# EAGLE schematic demeler_pcb (EAGLE 6.1)
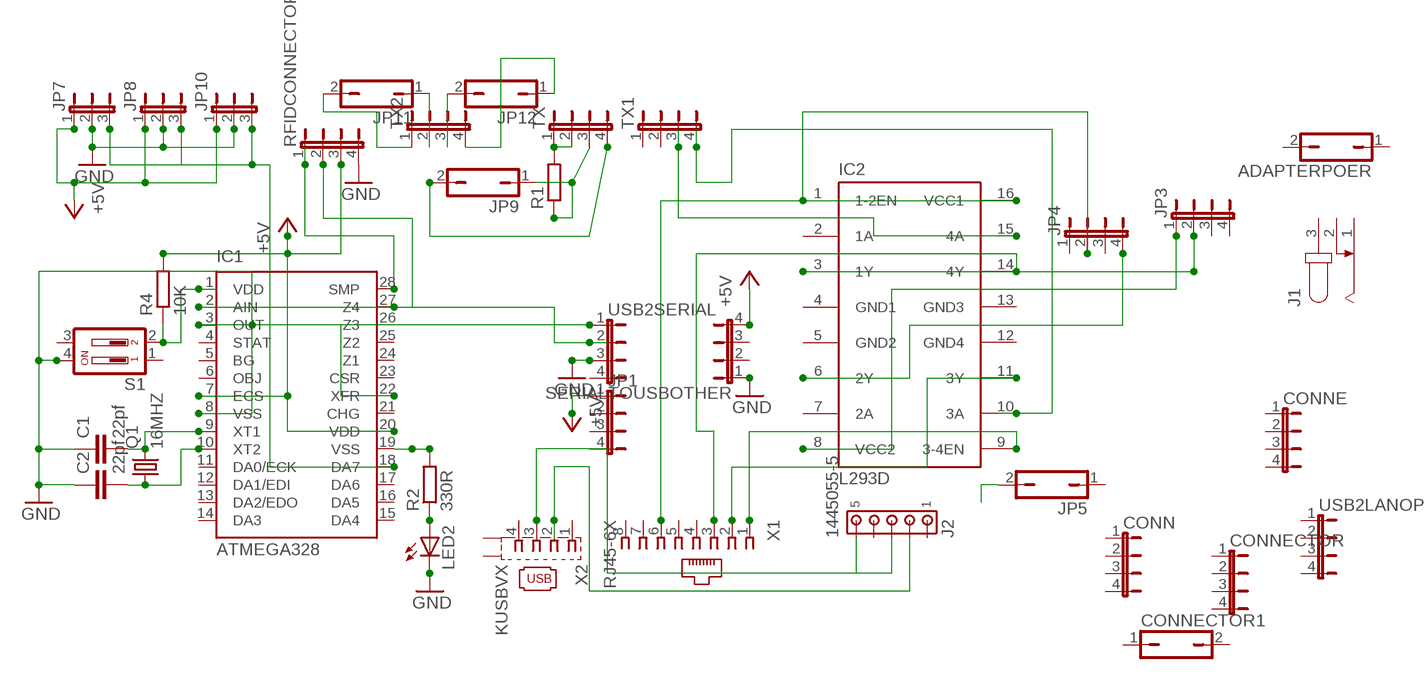
[diagram p0: schematic, sheet 1]

## Parts
ADAPTERPOER  JP1Q  [JP1]
C1  22pf  C2.5/2  [C2.5-2]
C2  22pf  C2.5/2  [C2.5-2]
CONN  JP4E  [JP4]
CONNE  JP4E  [JP4]
CONNECTOR  JP4E  [JP4]
CONNECTOR1  JP1Q  [JP1]
IC1  ATMEGA328  QT9701BD  [DIL28-3]
IC2  L293D  [DIL16]
J1  JACK-PLUG0  [SPC4077]
J2  1445055-5  [1445055-5]
JP1  JP4E  [JP4]
JP3  JP4E  [JP4]
JP4  JP4E  [JP4]
JP5  JP1Q  [JP1]
JP7  JP2E  [JP2]
JP8  JP2E  [JP2]
JP9  JP1Q  [JP1]
JP10  JP2E  [JP2]
JP11  JP1Q  [JP1]
JP12  JP1Q  [JP1]
LED2  LED3MM  [LED3MM]
Q1  16MHZ  CRYSTALHC49S  [HC49/S]
R1  R-EU_0204/7  [0204/7]
R2  330R  R-EU_0207/10  [0207/10]
R4  10K  R-EU_0207/10  [0207/10]
RFIDCONNECTOR  JP4E  [JP4]
S1  DP02  [DP-02]
SERIALTOUSBOTHER  JP4E  [JP4]
TX  JP4E  [JP4]
TX1  JP4E  [JP4]
TX2  JP4E  [JP4]
USB2LANOP  JP4E  [JP4]
USB2SERIAL  JP4E  [JP4]
X1  RJ45-6X  [RJ45-NO-SHIELD]
X2  KUSBVX  [KUSBVX]

## Nets
+5V: IC1.7(ECS) IC1.20(VDD) JP1.1 JP7.1 JP8.1 JP10.1 R4.2 RFIDCONNECTOR.3 SERIALTOUSBOTHER.4
GND: C1.1 C2.1 IC1.8(VSS) IC1.22(XFR) JP7.2 JP8.2 JP10.2 LED2.K(C) RFIDCONNECTOR.4 S1.4 SERIALTOUSBOTHER.1 USB2SERIAL.3
N$1: C1.2 IC1.9(XT1) Q1.2
N$2: C2.2 IC1.10(XT2) Q1.1
N$3: IC1.3(OUT) USB2SERIAL.1
N$4: J2.3 X2.3
N$5: IC1.19(VSS) R2.2
N$6: IC2.9(3-4EN) X1.1
N$7: IC2.11(3Y) X1.2
N$8: IC2.14(4Y) X1.3
N$9: IC2.16(VCC1) X1.6
N$10: IC2.8(VCC2) JP3.1
N$11: IC2.6(2Y) JP4.4
N$12: IC2.3(1Y) JP3.2
N$13: IC2.1(1-2EN) JP4.2
N$14: IC2.10(3A) TX1.4
N$15: IC2.15(4A) TX1.3
N$16: IC1.2(AIN) USB2SERIAL.2
N$17: R1.2 TX.1 TX.2
N$18: JP9.1 R1.1 TX.3
N$19: J2.5
N$20: J2.2 X2.2
N$21: JP9.2 TX.4
N$23: JP5.2
N$24: IC1.27(Z4) RFIDCONNECTOR.2
N$25: IC1.28(SMP) RFIDCONNECTOR.1
N$26: IC1.18(DA7) JP7.3 JP8.3 JP10.3
N$27: JP11.2 TX2.1
N$28: JP11.1 TX2.2
N$29: JP12.2 TX2.3
N$30: JP12.1 TX2.4
N$31: IC1.1(VDD) R4.1 S1.2
N$32: LED2.A R2.1
Unconnected: ADAPTERPOER.1 ADAPTERPOER.2 CONN.1 CONN.2 CONN.3 CONN.4 CONNE.1 CONNE.2 CONNE.3 CONNE.4 CONNECTOR1.1 CONNECTOR1.2 CONNECTOR.1 CONNECTOR.2 CONNECTOR.3 CONNECTOR.4 IC1.4(STAT) IC1.5(BG) IC1.6(OBJ) IC1.11(DA0/ECK) IC1.12(DA1/EDI) IC1.13(DA2/EDO) IC1.14(DA3) IC1.15(DA4) IC1.16(DA5) IC1.17(DA6) IC1.21(CHG) IC1.23(CSR) IC1.24(Z1) IC1.25(Z2) IC1.26(Z3) IC2.2(1A) IC2.7(2A) J1.1 J1.2 J1.3 J2.1 J2.4 JP1.2 JP1.3 JP1.4 JP3.3 JP3.4 JP4.1 JP4.3 JP5.1 S1.1 S1.3 SERIALTOUSBOTHER.2 SERIALTOUSBOTHER.3 TX1.1 TX1.2 USB2LANOP.1 USB2LANOP.2 USB2LANOP.3 USB2LANOP.4 USB2SERIAL.4 X1.4 X1.5 X1.7 X1.8 X2.1 X2.4 X2.M1(S1) X2.M2(S2)

## Power pins joined to a net without a drawn wire
GND1: IC2.4(GND1)
GND2: IC2.5(GND2)
GND3: IC2.13(GND3)
GND4: IC2.12(GND4)

## Library data of the parts
ADAPTERPOER CONNECTOR1 JP5 JP9 JP11 JP12 = jumper:JP1Q: JUMPER
C1 C2 = capacitor-wima:C: CAPACITOR naming: grid - package width
CONN CONNE CONNECTOR JP1 JP3 JP4 RFIDCONNECTOR SERIALTOUSBOTHER TX TX1 TX2 USB2LANOP USB2SERIAL = jumper:JP4E: JUMPER
IC1 = quantum-research-group:QT9701B: Charge-Transfer Capacitance Sensor IC Source: http://data.qprox.com/downloads/datasheets/qt9701b.pdf; OC_FARNELL: unknown; OC_NEWARK: unknown
IC2 = st-microelectronics:L293D: PUSH-PULL 4 CHANNEL DRIVER; MPN: L293D; OC_FARNELL: 9589619; OC_NEWARK: 56P8249
J1 = con-jack:JACK-PLUG: DC POWER JACK Power Jack, DC, Right Angle, Through Hole, Rated 5A at 16VDC, PC Terminals Distributor: Farnell (www.Farnell.de) Drawing: 84N1161.pdf / 84N1162.pdf Manufacturer: SPC Technology (www.spctechnology.com) Type: SPC4077 / SPC 4078; OC_FARNELL: unknown; OC_NEWARK: unknown
J2 = con-amp:1445055-5: Micro MATE-N-LOK Connectors grid 1.5 mm Source: ENG_CD_1445055_A.pdf
JP7 JP8 JP10 = jumper:JP2E: JUMPER
LED2 = led:LED: LED OSRAM: - CHIPLED LG R971, LG N971, LY N971, LG Q971, LY Q971, LO R971, LY R971 LH N974, LH R974 LS Q976, LO Q976, LY Q976 LO Q996 - Hyper CHIPLED LW Q18S LB Q993, LB Q99A, LB R99A - SideLED LS A670, LO A670, LY A670, LG A670, LP A670 LB A673, LV A673, LT A673, LW A673 LH A674 LY A675 LS A676, LA A676, LO A676, LY A676, LW A676 LS A679, LY A679, LG A679 - Hyper Micro SIDELED® LS Y876, LA Y876, LO Y876, LY Y876 LT Y87S - SmartLED LW L88C, LW L88S LB L89C, LB L89S, LG L890 LS L89K, LO L89K, LY L89K LS L896, LA L896, LO L896, LY L896 - TOPLED LS T670, LO T670, LY T670, LG T670, LP T670 LSG T670, LSP T670, LSY T670, LOP T670, LYG T670 LG T671, LOG T671, LSG T671 LB T673, LV T673, LT T673, LW T673 LH T674 LS T676, LA T676, LO T676, LY T676, LB T676, LH T676, LSB T676, LW T676 LB T67C, LV T67C, LT T67C, LS T67K, LO T67K, LY T67K, LW E67C LS E67B, LA E67B, LO E67B, LY E67B, LB E67C, LV E67C, LT E67C LW T67C LS T679, LY T679, LG T679 LS T770, LO T770, LY T770, LG T770, LP T770 LB T773, LV T773, LT T773, LW T773 LH T774 LS E675, LA E675, LY E675, LS T675 LS T776, LA T776, LO T776, LY T776, LB T776 LHGB T686 LT T68C, LB T68C - Hyper Mini TOPLED® LB M676 - Mini TOPLED Santana® LG M470 LS M47K, LO M47K, LY M47K Source: http://www.osram.convergy.de LUXEON: - LUMILED® LXK2-PW12-R00, LXK2-PW12-S00, LXK2-PW14-U00, LXK2-PW14-V00 LXK2-PM12-R00, LXK2-PM12-S00, LXK2-PM14-U00 LXK2-PE12-Q00, LXK2-PE12-R00, LXK2-PE12-S00, LXK2-PE14-T00, LXK2-PE14-U00 LXK2-PB12-K00, LXK2-PB12-L00, LXK2-PB12-M00, LXK2-PB14-N00, LXK2-PB14-P00, LXK2-PB14-Q00 LXK2-PR12-L00, LXK2-PR12-M00, LXK2-PR14-Q00, LXK2-PR14-R00 LXK2-PD12-Q00, LXK2-PD12-R00, LXK2-PD12-S00 LXK2-PH12-R00, LXK2-PH12-S00 LXK2-PL12-P00, LXK2-PL12-Q00, LXK2-PL12-R00 Source: www.luxeon.com KINGBRIGHT: KA-3528ASYC Source: www.kingbright.com
Q1 = crystal:CRYSTAL: CRYSTAL; OC_FARNELL: 1667008; OC_NEWARK: unknown
R1 R2 R4 = rcl:R-EU_: RESISTOR, European symbol
S1 = switch-dil:DP02: DIL/CODE SWITCH; MPN: MCDP02; OC_FARNELL: 1255233; OC_NEWARK: 26M1095
X1 = con-tycoelectronics:RJ45: CORCOM Modular RJ Jacks No Shield Source: www.tycoelectronics.com .. ENG_DS_1654001_1099_RJ_L_0507.pdf; MPN: RJ45-6X; OC_FARNELL: unknown; OC_NEWARK: 01P1604
X2 = con-kycon:KUSBVX: Vertical,Top Entry Universal Serial Bus Connector KUSBVX Series Source: KYCON Sibalco USB vertical socket KUSBV.pdf